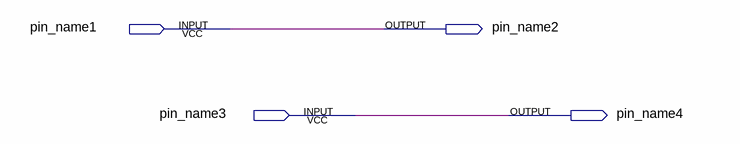
[diagram p0: schematic sheet]
// Quartus schematic test.bdf as structural Verilog: 0 symbols, 4 pins
module test (
  input  pin_name1,
  input  pin_name3,
  output pin_name2,
  output pin_name4
);


  assign pin_name2 = pin_name1;
  assign pin_name4 = pin_name3;
endmodule
